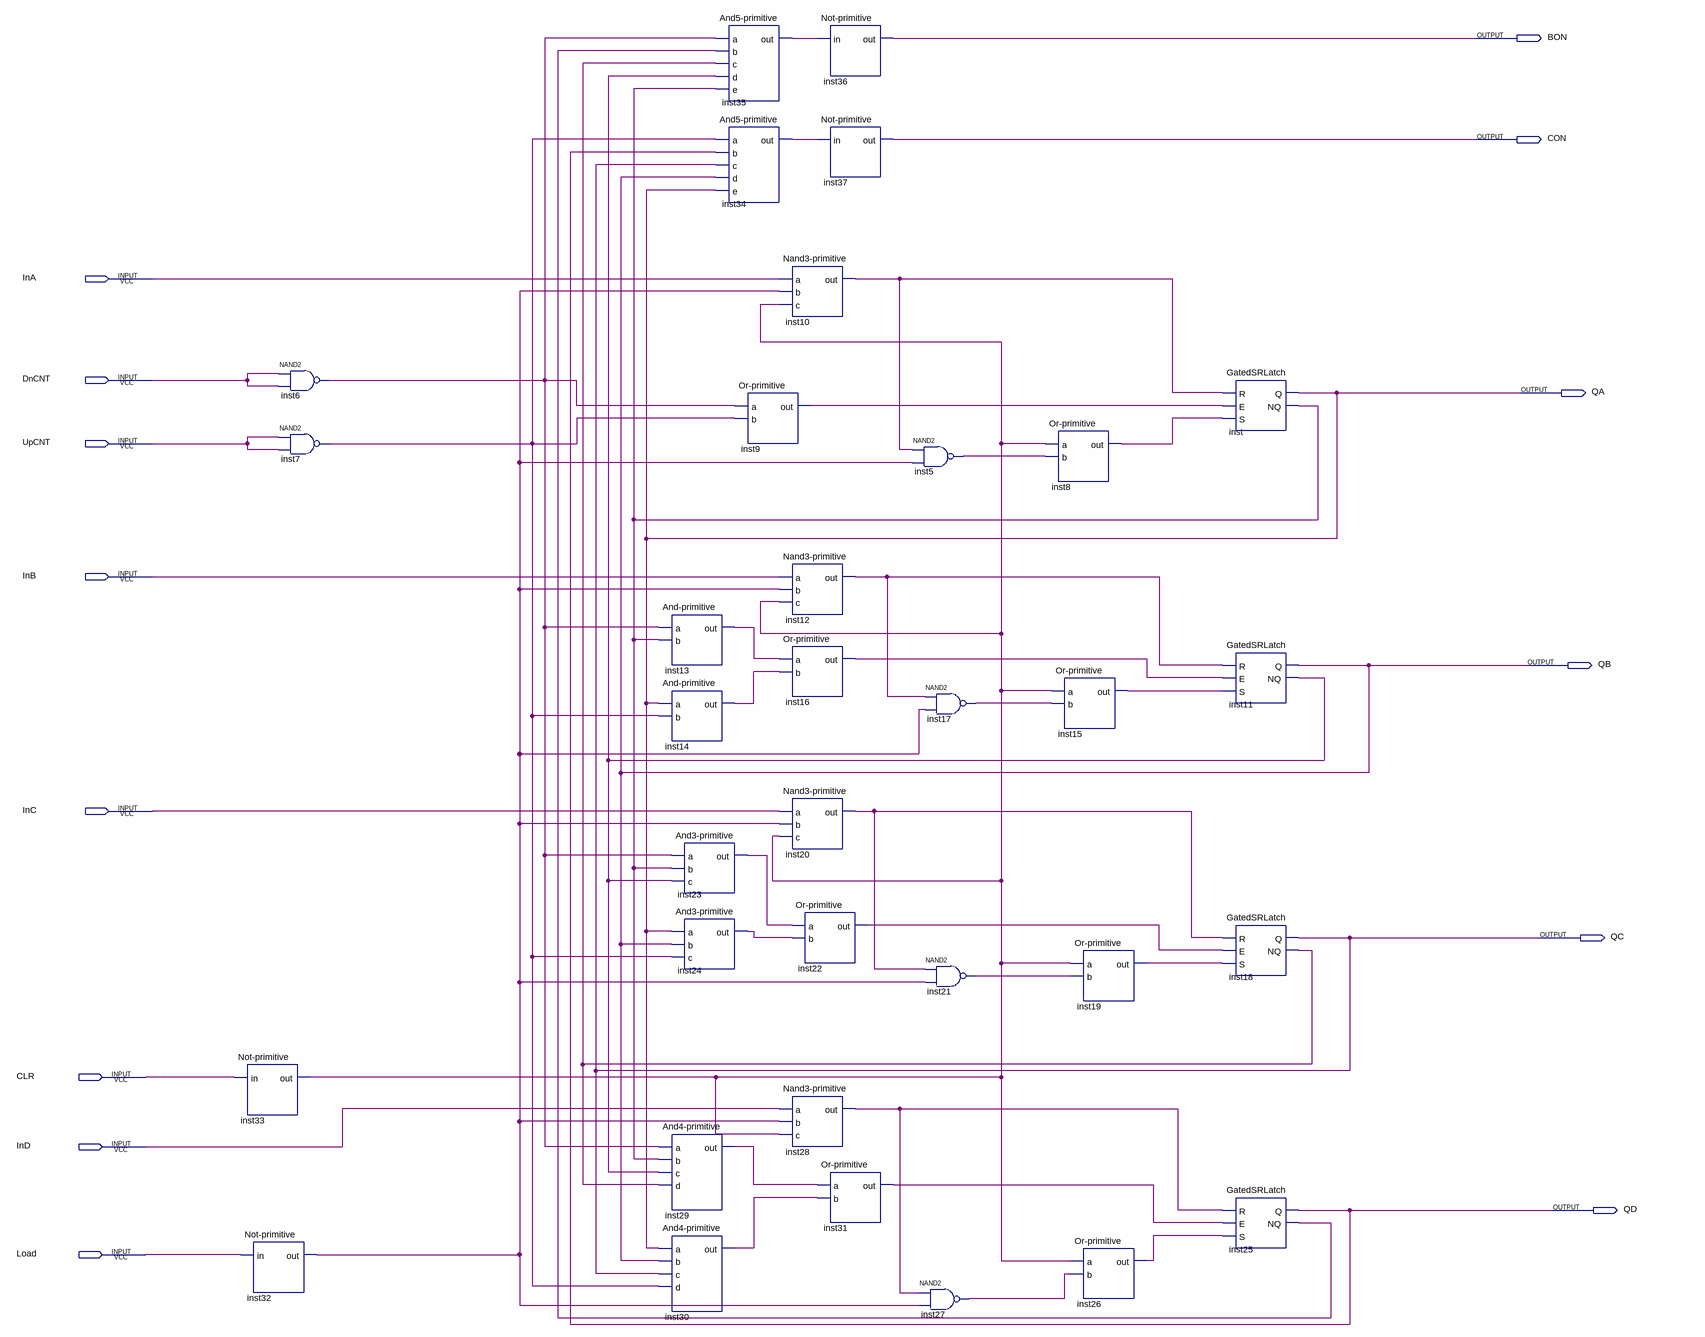
[diagram p0: schematic sheet]
// Quartus schematic 74193-4Bit-Counter.bdf as structural Verilog: 34 symbols, 14 pins
module \74193-4Bit-Counter  (
  input  InA,
  input  DnCNT,
  input  UpCNT,
  input  InB,
  input  InC,
  input  CLR,
  input  InD,
  input  Load,
  output BON,
  output CON,
  output QA,
  output QB,
  output QC,
  output QD
);

  wire inst5_out, inst6_out, inst7_out, inst8_out, inst9_out, inst10_out, inst11_nq, inst12_out, inst13_out,
       inst14_out, inst15_out, inst16_out, inst17_out, inst18_nq, inst19_out, inst20_out, inst21_out,
       inst22_out, inst23_out, inst24_out, inst25_nq, inst26_out, inst27_out, inst28_out, inst29_out,
       inst30_out, inst31_out, inst32_out, inst33_out, inst34_out, inst35_out, inst_nq;

  \Not-primitive  inst33 (.in(CLR), .out(inst33_out));
  nand inst6 (inst6_out, DnCNT, DnCNT);
  nand inst7 (inst7_out, UpCNT, UpCNT);
  \Not-primitive  inst32 (.in(Load), .out(inst32_out));
  \And-primitive  inst13 (.a(inst6_out), .b(inst_nq), .out(inst13_out));
  \And-primitive  inst14 (.a(QA), .b(inst7_out), .out(inst14_out));
  \And3-primitive  inst23 (.a(inst6_out), .b(inst_nq), .c(inst11_nq), .out(inst23_out));
  \And3-primitive  inst24 (.a(QA), .b(QB), .c(inst7_out), .out(inst24_out));
  \And4-primitive  inst29 (.a(inst6_out), .b(inst_nq), .c(inst11_nq), .d(inst18_nq), .out(inst29_out));
  \And4-primitive  inst30 (.a(QA), .b(QB), .c(QC), .d(inst7_out), .out(inst30_out));
  \And5-primitive  inst35 (.a(inst6_out), .b(inst25_nq), .c(inst18_nq), .d(inst11_nq), .e(inst_nq), .out(inst35_out));
  \And5-primitive  inst34 (.a(inst7_out), .b(QD), .c(QC), .d(QB), .e(QA), .out(inst34_out));
  \Or-primitive  inst9 (.a(inst6_out), .b(inst7_out), .out(inst9_out));
  \Nand3-primitive  inst10 (.a(InA), .b(inst32_out), .c(inst33_out), .out(inst10_out));
  \Nand3-primitive  inst12 (.a(InB), .b(inst32_out), .c(inst33_out), .out(inst12_out));
  \Or-primitive  inst16 (.a(inst13_out), .b(inst14_out), .out(inst16_out));
  \Nand3-primitive  inst20 (.a(InC), .b(inst32_out), .c(inst33_out), .out(inst20_out));
  \Or-primitive  inst22 (.a(inst23_out), .b(inst24_out), .out(inst22_out));
  \Nand3-primitive  inst28 (.a(InD), .b(inst32_out), .c(inst33_out), .out(inst28_out));
  \Not-primitive  inst36 (.in(inst35_out), .out(BON));
  \Not-primitive  inst37 (.in(inst34_out), .out(CON));
  \Or-primitive  inst31 (.a(inst29_out), .b(inst30_out), .out(inst31_out));
  nand inst5 (inst5_out, inst10_out, inst32_out);
  nand inst17 (inst17_out, inst12_out, inst32_out);
  nand inst21 (inst21_out, inst20_out, inst32_out);
  nand inst27 (inst27_out, inst28_out, inst32_out);
  \Or-primitive  inst8 (.a(inst33_out), .b(inst5_out), .out(inst8_out));
  \Or-primitive  inst15 (.a(inst33_out), .b(inst17_out), .out(inst15_out));
  \Or-primitive  inst19 (.a(inst33_out), .b(inst21_out), .out(inst19_out));
  \Or-primitive  inst26 (.a(inst33_out), .b(inst27_out), .out(inst26_out));
  GatedSRLatch inst (.R(inst10_out), .E(inst9_out), .S(inst8_out), .Q(QA), .NQ(inst_nq));
  GatedSRLatch inst11 (.R(inst12_out), .E(inst16_out), .S(inst15_out), .Q(QB), .NQ(inst11_nq));
  GatedSRLatch inst18 (.R(inst20_out), .E(inst22_out), .S(inst19_out), .Q(QC), .NQ(inst18_nq));
  GatedSRLatch inst25 (.R(inst28_out), .E(inst31_out), .S(inst26_out), .Q(QD), .NQ(inst25_nq));
endmodule
